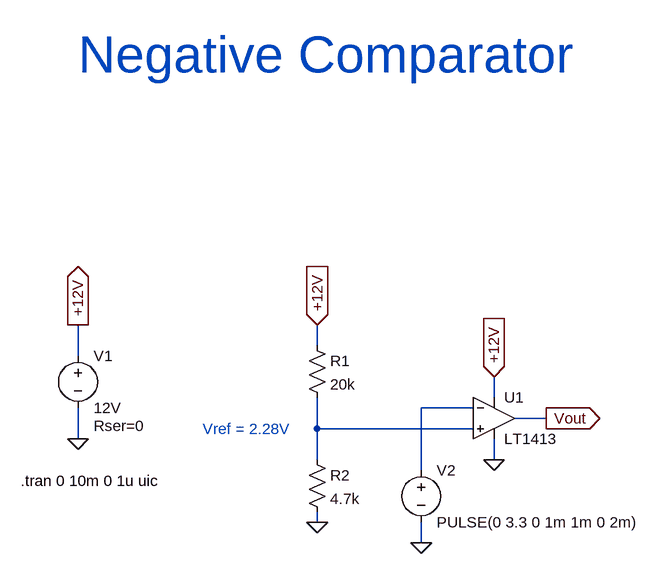
[diagram p0: schematic Op-Amp Negative Comparator.asc]
Op-Amp Negative Comparator.asc, the LTspice schematic file:
Version 4.1
SHEET 1 880 680
WIRE -64 64 -64 32
WIRE -432 80 -432 32
WIRE 208 144 208 112
WIRE 176 160 96 160
WIRE 288 176 240 176
WIRE -64 192 -64 144
WIRE 176 192 -64 192
WIRE -432 208 -432 160
WIRE -64 240 -64 192
WIRE 208 240 208 208
WIRE 96 256 96 160
WIRE -64 336 -64 320
WIRE 96 368 96 336
FLAG -64 336 0
FLAG -432 208 0
FLAG -432 32 +12V
IOPIN -432 32 Out
FLAG -64 32 +12V
IOPIN -64 32 In
FLAG 208 112 +12V
IOPIN 208 112 In
FLAG 208 240 0
FLAG 288 176 Vout
IOPIN 288 176 Out
FLAG 96 368 0
SYMBOL OpAmps\\LT1413 208 112 R0
SYMATTR InstName U1
SYMBOL res -80 48 R0
SYMATTR InstName R1
SYMATTR Value 20k
SYMBOL res -80 224 R0
SYMATTR InstName R2
SYMATTR Value 4.7k
SYMBOL voltage -432 64 R0
WINDOW 123 0 0 Left 0
WINDOW 39 24 124 Left 2
SYMATTR InstName V1
SYMATTR Value 12V
SYMATTR SpiceLine Rser=0
SYMBOL voltage 96 240 R0
WINDOW 123 0 0 Left 0
WINDOW 39 0 0 Left 0
SYMATTR InstName V2
SYMATTR Value PULSE(0 3.3 0 1m 1m 0 2m)
TEXT -520 272 Left 2 !.tran 0 10m 0 1u uic
TEXT -240 192 Left 2 ;Vref = 2.28V
TEXT -432 -384 Left 6 ;Negative Comparator

The netlist it stands for:
* Op-Amp Negative Comparator.asc
X§U1 N002 N001 +12V 0 Vout LT1413  ; pins In+ In- V+ V- OUT
R1 +12V N002 20k
R2 N002 0 4.7k
V1 +12V 0 12V Rser=0
V2 N001 0 PULSE(0 3.3 0 1m 1m 0 2m)
.tran 0 10m 0 1u uic
* Vref = 2.28V
* Negative Comparator
.lib LTC.lib
.backanno
.end